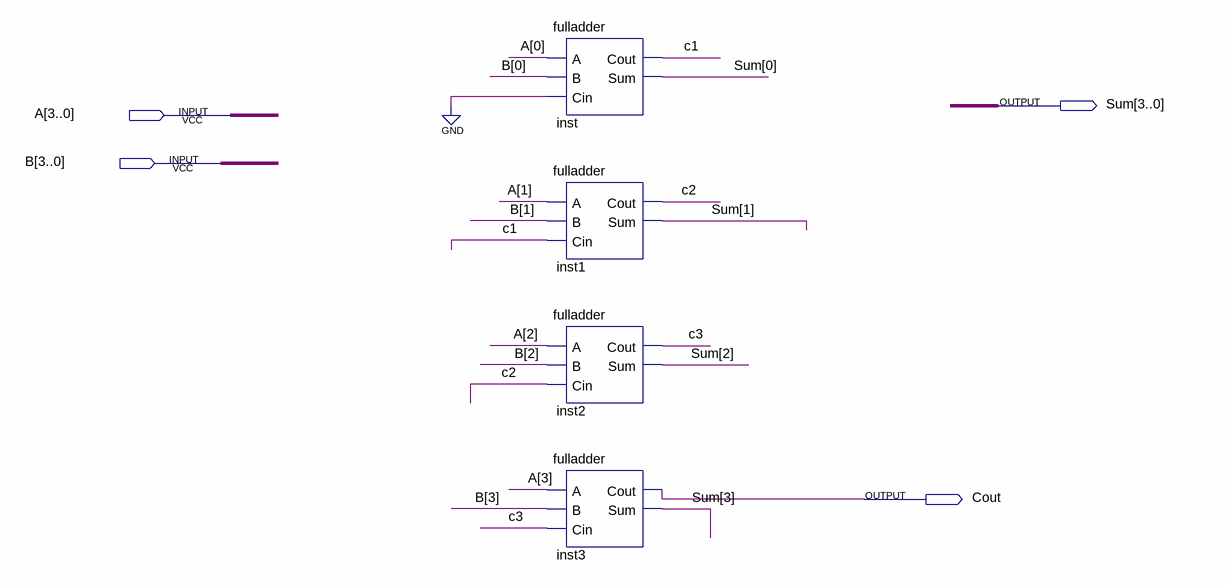
[diagram p0: schematic sheet]
// Quartus schematic fourbit_adder.bdf as structural Verilog: 4 symbols, 4 pins
module fourbit_adder (
  input  [3:0] A,
  input  [3:0] B,
  output [3:0] Sum,
  output Cout
);

  wire c1, c2, c3;

  fulladder inst (.A(A[0]), .B(B[0]), .Cin(1'b0), .Cout(c1), .Sum(Sum[0]));
  fulladder inst1 (.A(A[1]), .B(B[1]), .Cin(c1), .Cout(c2), .Sum(Sum[1]));
  fulladder inst2 (.A(A[2]), .B(B[2]), .Cin(c2), .Cout(c3), .Sum(Sum[2]));
  fulladder inst3 (.A(A[3]), .B(B[3]), .Cin(c3), .Cout(Cout), .Sum(Sum[3]));
endmodule
